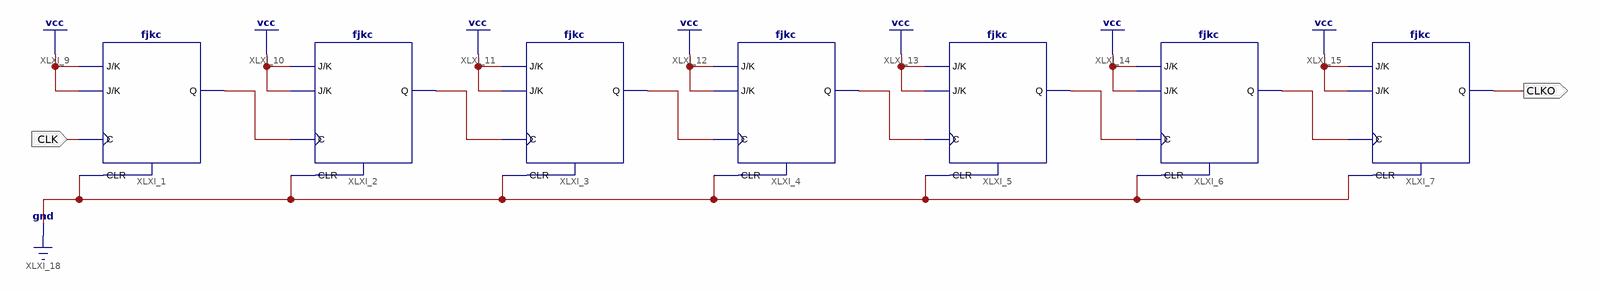
[diagram p0: schematic sheet 1]
// Xilinx ISE schematic clkdiv128.sch (spartan6) as structural Verilog: 7 symbols, 2 ports
module clkdiv128 (
  input  CLK,
  output CLKO
);

  wire XLXN_1, XLXN_2, XLXN_3, XLXN_4, XLXN_6, XLXN_7;

  fjkc XLXI_1 (.C(CLK), .CLR(1'b0), .J(1'b1), .K(1'b1), .Q(XLXN_1));
  fjkc XLXI_2 (.C(XLXN_1), .CLR(1'b0), .J(1'b1), .K(1'b1), .Q(XLXN_2));
  fjkc XLXI_3 (.C(XLXN_2), .CLR(1'b0), .J(1'b1), .K(1'b1), .Q(XLXN_3));
  fjkc XLXI_4 (.C(XLXN_3), .CLR(1'b0), .J(1'b1), .K(1'b1), .Q(XLXN_7));
  fjkc XLXI_5 (.C(XLXN_7), .CLR(1'b0), .J(1'b1), .K(1'b1), .Q(XLXN_4));
  fjkc XLXI_6 (.C(XLXN_4), .CLR(1'b0), .J(1'b1), .K(1'b1), .Q(XLXN_6));
  fjkc XLXI_7 (.C(XLXN_6), .CLR(1'b0), .J(1'b1), .K(1'b1), .Q(CLKO));
endmodule
